# EAGLE design progduino (EAGLE 8.5.2)
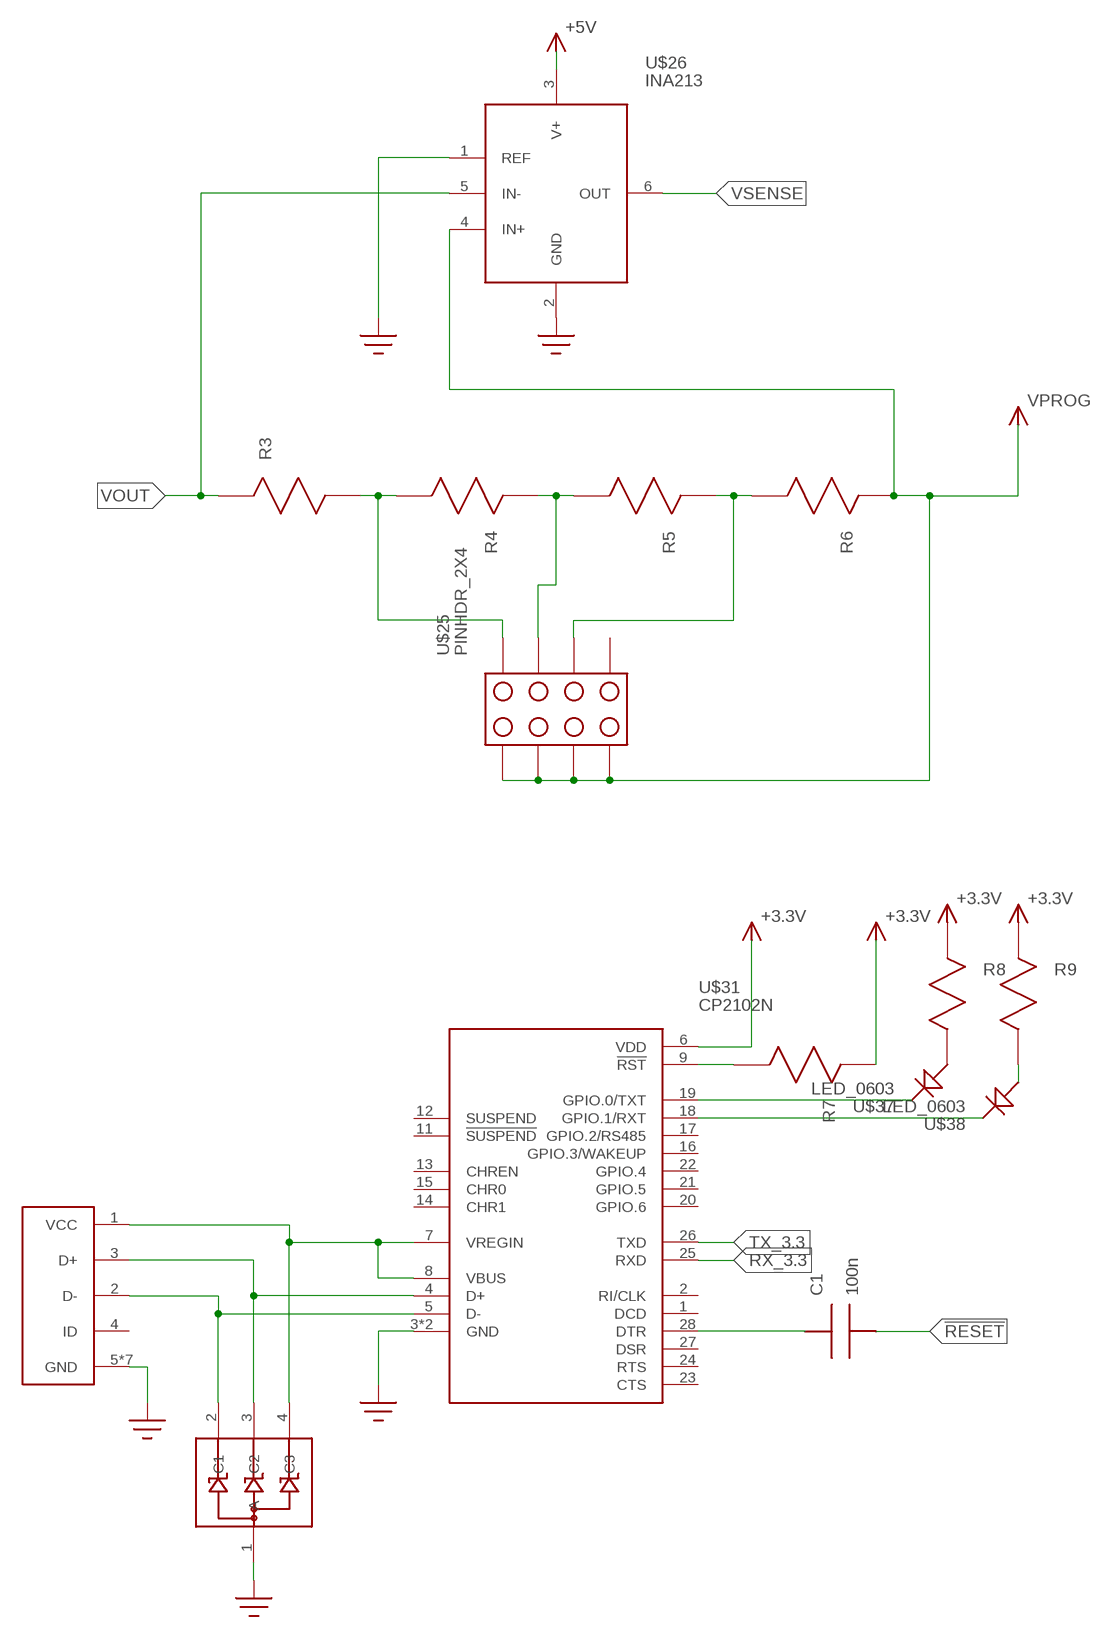
[diagram p0: schematic, sheet 1, part 1 of 2]
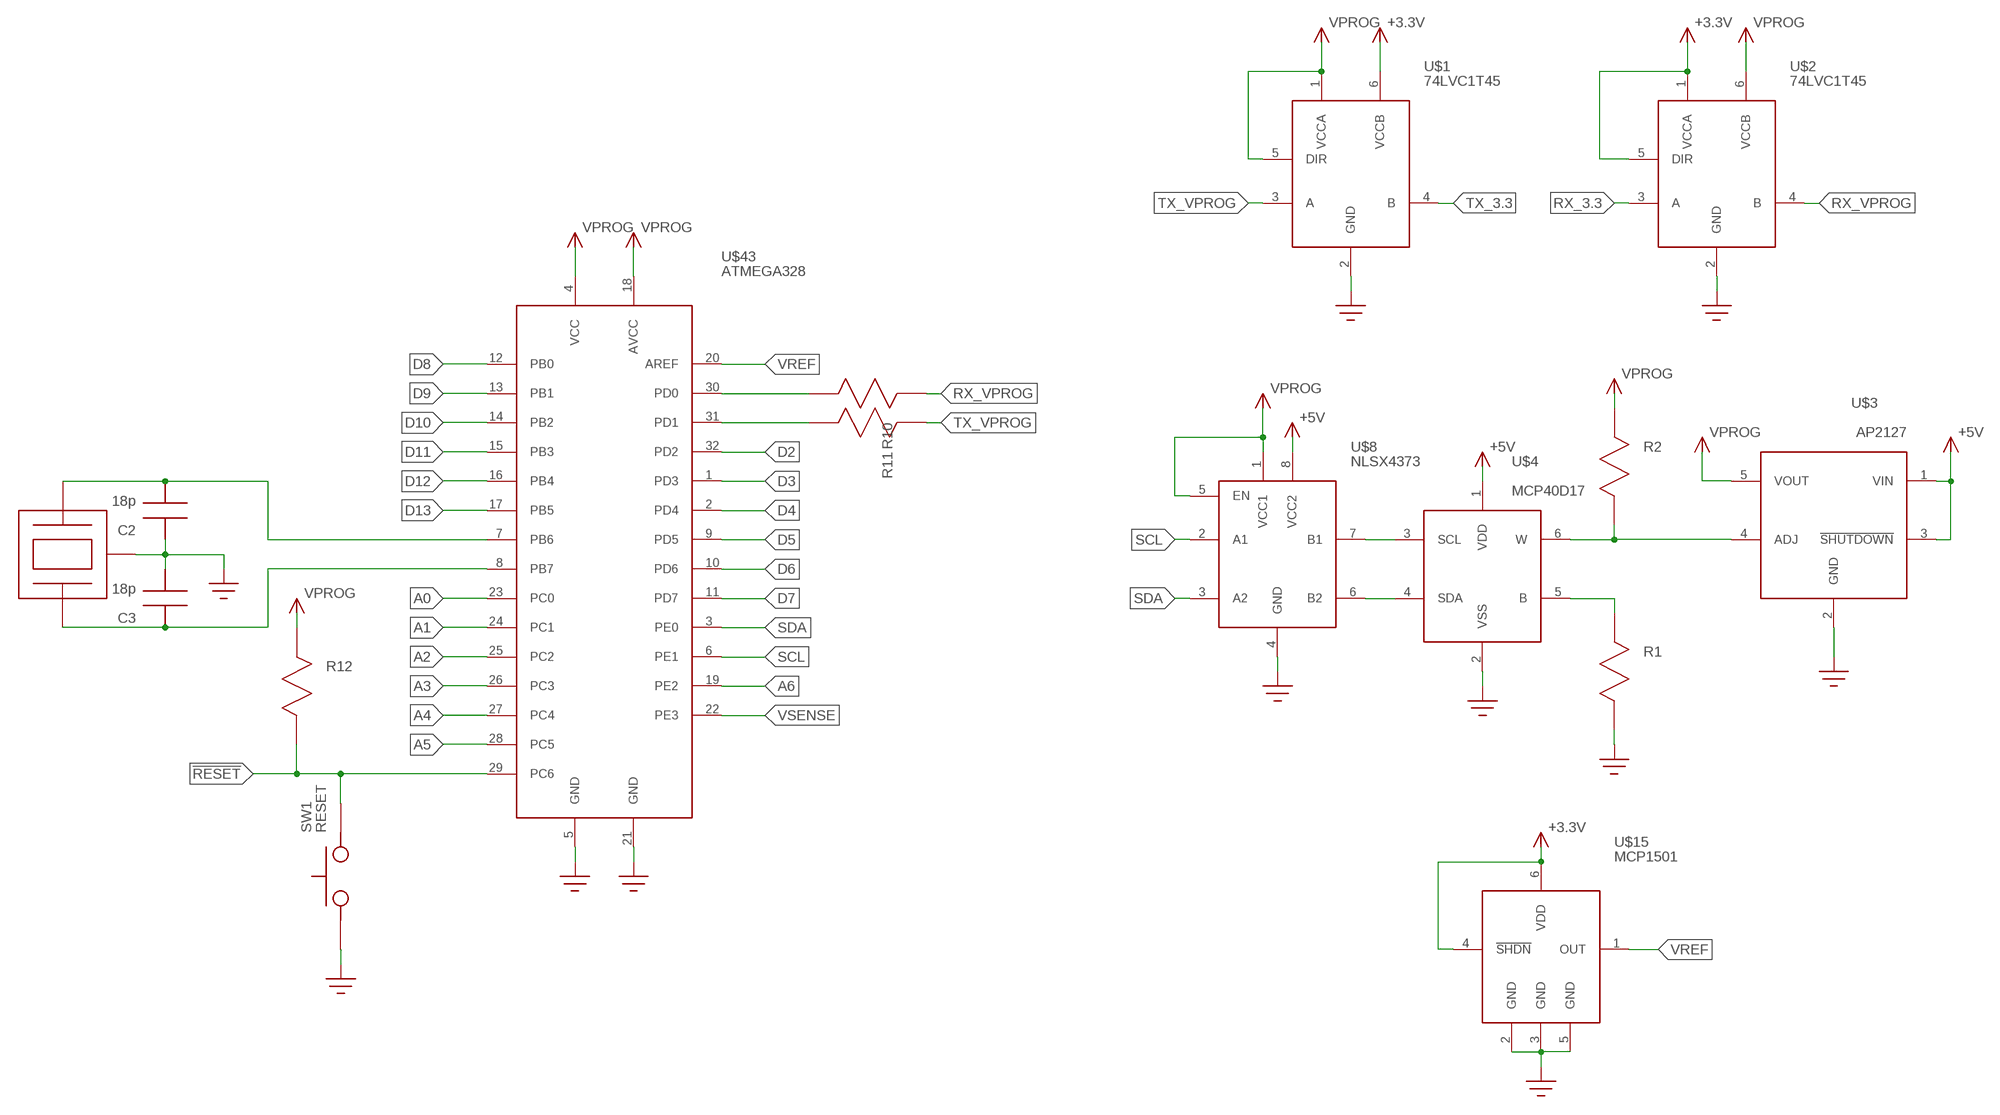
[diagram p1: schematic, sheet 1, part 2 of 2]

## Parts
C1  100n  C0603  [C0603]
C2  18p  C0603  [C0603]
C3  18p  C0603  [C0603]
R1  R0603  [R0603]
R2  R0603  [R0603]
R3  R0805  [R0805]
R4  R0805  [R0805]
R5  R0805  [R0805]
R6  R0805  [R0805]
R7  R0603  [R0603]
R8  R0603  [R0603]
R9  R0603  [R0603]
R10  R0603  [R0603]
R11  R0603  [R0603]
R12  R0603  [R0603]
SW1  RESET  SMD_SWITCH  [SMD_SWITCH]
U$1  74LVC1T45  [SOT23-6]
U$2  74LVC1T45  [SOT23-6]
U$3  AP2127  [SOT23-5]
U$4  MCP40D17  [SC70-6]
U$8  NLSX4373  [SOIC8]
U$15  MCP1501  [SOT23-6]
U$25  PINHDR_2X4  [PINHDR_2X4]
U$26  INA213  [SC70-6]
U$31  CP2102N  [QFN28]
U$37  LED_0603  [LED_0603]
U$38  LED_0603  [LED_0603]
U$39  USB_JACK  [FCI_MICRO_USB]
U$40  SP0503_TVS  [SOT143]
U$43  ATMEGA328  [TQFP32_7X7]
U$49  XTAL  [CRYSTAL_3.2X2.5]

## Nets
!RESET!: C1.P$2 R12.P$2 SW1.P$3 SW1.P$4 U$43.29(PC6)
+3.3V: R7.P$1 R8.P$1 R9.P$1 U$1.6(VCCB) U$2.1(VCCA) U$2.5(DIR) U$15.4(!SHDN!) U$15.6(VDD) U$31.6(VDD)
+5V: U$3.1(VIN) U$3.3(!SHUTDOWN!) U$4.1(VDD) U$8.8(VCC2) U$26.3(V+)
A0: U$43.23(PC0)
A1: U$43.24(PC1)
A2: U$43.25(PC2)
A3: U$43.26(PC3)
A4: U$43.27(PC4)
A5: U$43.28(PC5)
A6: U$43.19(PE2)
D2: U$43.32(PD2)
D3: U$43.1(PD3)
D4: U$43.2(PD4)
D5: U$43.9(PD5)
D6: U$43.10(PD6)
D7: U$43.11(PD7)
D8: U$43.12(PB0)
D9: U$43.13(PB1)
D10: U$43.14(PB2)
D11: U$43.15(PB3)
D12: U$43.16(PB4)
D13: U$43.17(PB5)
GND: C2.P$1 C3.P$2 R1.P$2 SW1.P$1 SW1.P$2 U$1.2(GND) U$2.2(GND) U$3.2(GND) U$4.2(VSS) U$8.4(GND) U$15.2(GND) U$15.3(GND) U$15.5(GND) U$26.1(REF) U$26.2(GND) U$31.3(GND) U$31.PAD(GND) U$39.5(GND) U$39.GND1(GND) U$39.GND2(GND) U$39.GND3(GND) U$39.GND4(GND) U$39.GND5(GND) U$39.GND6(GND) U$40.1(A) U$43.5(GND) U$43.21(GND) U$49.P$2(P$CASE) U$49.P$4(P$CASE)
N$1: R2.P$2 U$3.4(ADJ) U$4.6(W)
N$2: R1.P$1 U$4.5(B)
N$3: U$4.3(SCL) U$8.7(B1)
N$4: U$4.4(SDA) U$8.6(B2)
N$5: R3.P$2 R4.P$2 U$25.8
N$6: R4.P$1 R5.P$2 U$25.7
N$7: R5.P$1 R6.P$2 U$25.6
N$8: R7.P$2 U$31.9(!RST!)
N$9: U$31.7(VREGIN) U$31.8(VBUS) U$39.1(VCC) U$40.4(C3)
N$10: R8.P$2 U$37.A
N$11: R9.P$2 U$38.A
N$12: U$31.19(GPIO.0/TXT) U$37.C
N$13: U$31.18(GPIO.1/RXT) U$38.C
N$14: U$31.5(D-) U$39.2(D-) U$40.2(C1)
N$15: U$31.4(D+) U$39.3(D+) U$40.3(C2)
N$17: C1.P$1 U$31.28(DTR)
N$18: R10.P$2 U$43.30(PD0)
N$19: R11.P$2 U$43.31(PD1)
N$25: C3.P$1 U$43.8(PB7) U$49.P$3(P$X2)
N$26: C2.P$2 U$43.7(PB6) U$49.P$1(P$X1)
RX_3.3: U$2.3(A) U$31.25(RXD)
RX_VPROG: R10.P$1 U$2.4(B)
SCL: U$8.2(A1) U$43.6(PE1)
SDA: U$8.3(A2) U$43.3(PE0)
TX_3.3: U$1.4(B) U$31.26(TXD)
TX_VPROG: R11.P$1 U$1.3(A)
VOUT: R3.P$1 U$26.5(IN-)
VPROG: R2.P$1 R6.P$1 R12.P$1 U$1.1(VCCA) U$1.5(DIR) U$2.6(VCCB) U$3.5(VOUT) U$8.1(VCC1) U$8.5(EN) U$25.1 U$25.2 U$25.3 U$25.4 U$26.4(IN+) U$43.4(VCC) U$43.18(AVCC)
VREF: U$15.1(OUT) U$43.20(AREF)
VSENSE: U$26.6(OUT) U$43.22(PE3)
Unconnected: U$25.5 U$31.1(DCD) U$31.2(RI/CLK) U$31.11(!SUSPEND!) U$31.12(SUSPEND) U$31.13(CHREN) U$31.14(CHR1) U$31.15(CHR0) U$31.16(GPIO.3/WAKEUP) U$31.17(GPIO.2/RS485) U$31.20(GPIO.6) U$31.21(GPIO.5) U$31.22(GPIO.4) U$31.23(CTS) U$31.24(RTS) U$31.27(DSR) U$39.4(ID)

## Library data of the parts
C1-C3 = progduino:C
R1-R12 = progduino:R
SW1 = progduino:SMD_SWITCH
U$1 U$2 = progduino:74LVC1T45
U$3 = progduino:AP2127
U$4 = progduino:MCP40D17
U$8 = progduino:NLSX4373
U$15 = progduino:MCP1501
U$25 = progduino:PINHDR_2X4
U$26 = progduino:INA213
U$31 = progduino:CP2102N
U$37 U$38 = progduino:LED_0603
U$39 = progduino:USB_JACK
U$40 = progduino:SP0503_TVS
U$43 = progduino:ATMEGA328
U$49 = progduino:XTAL

## Board
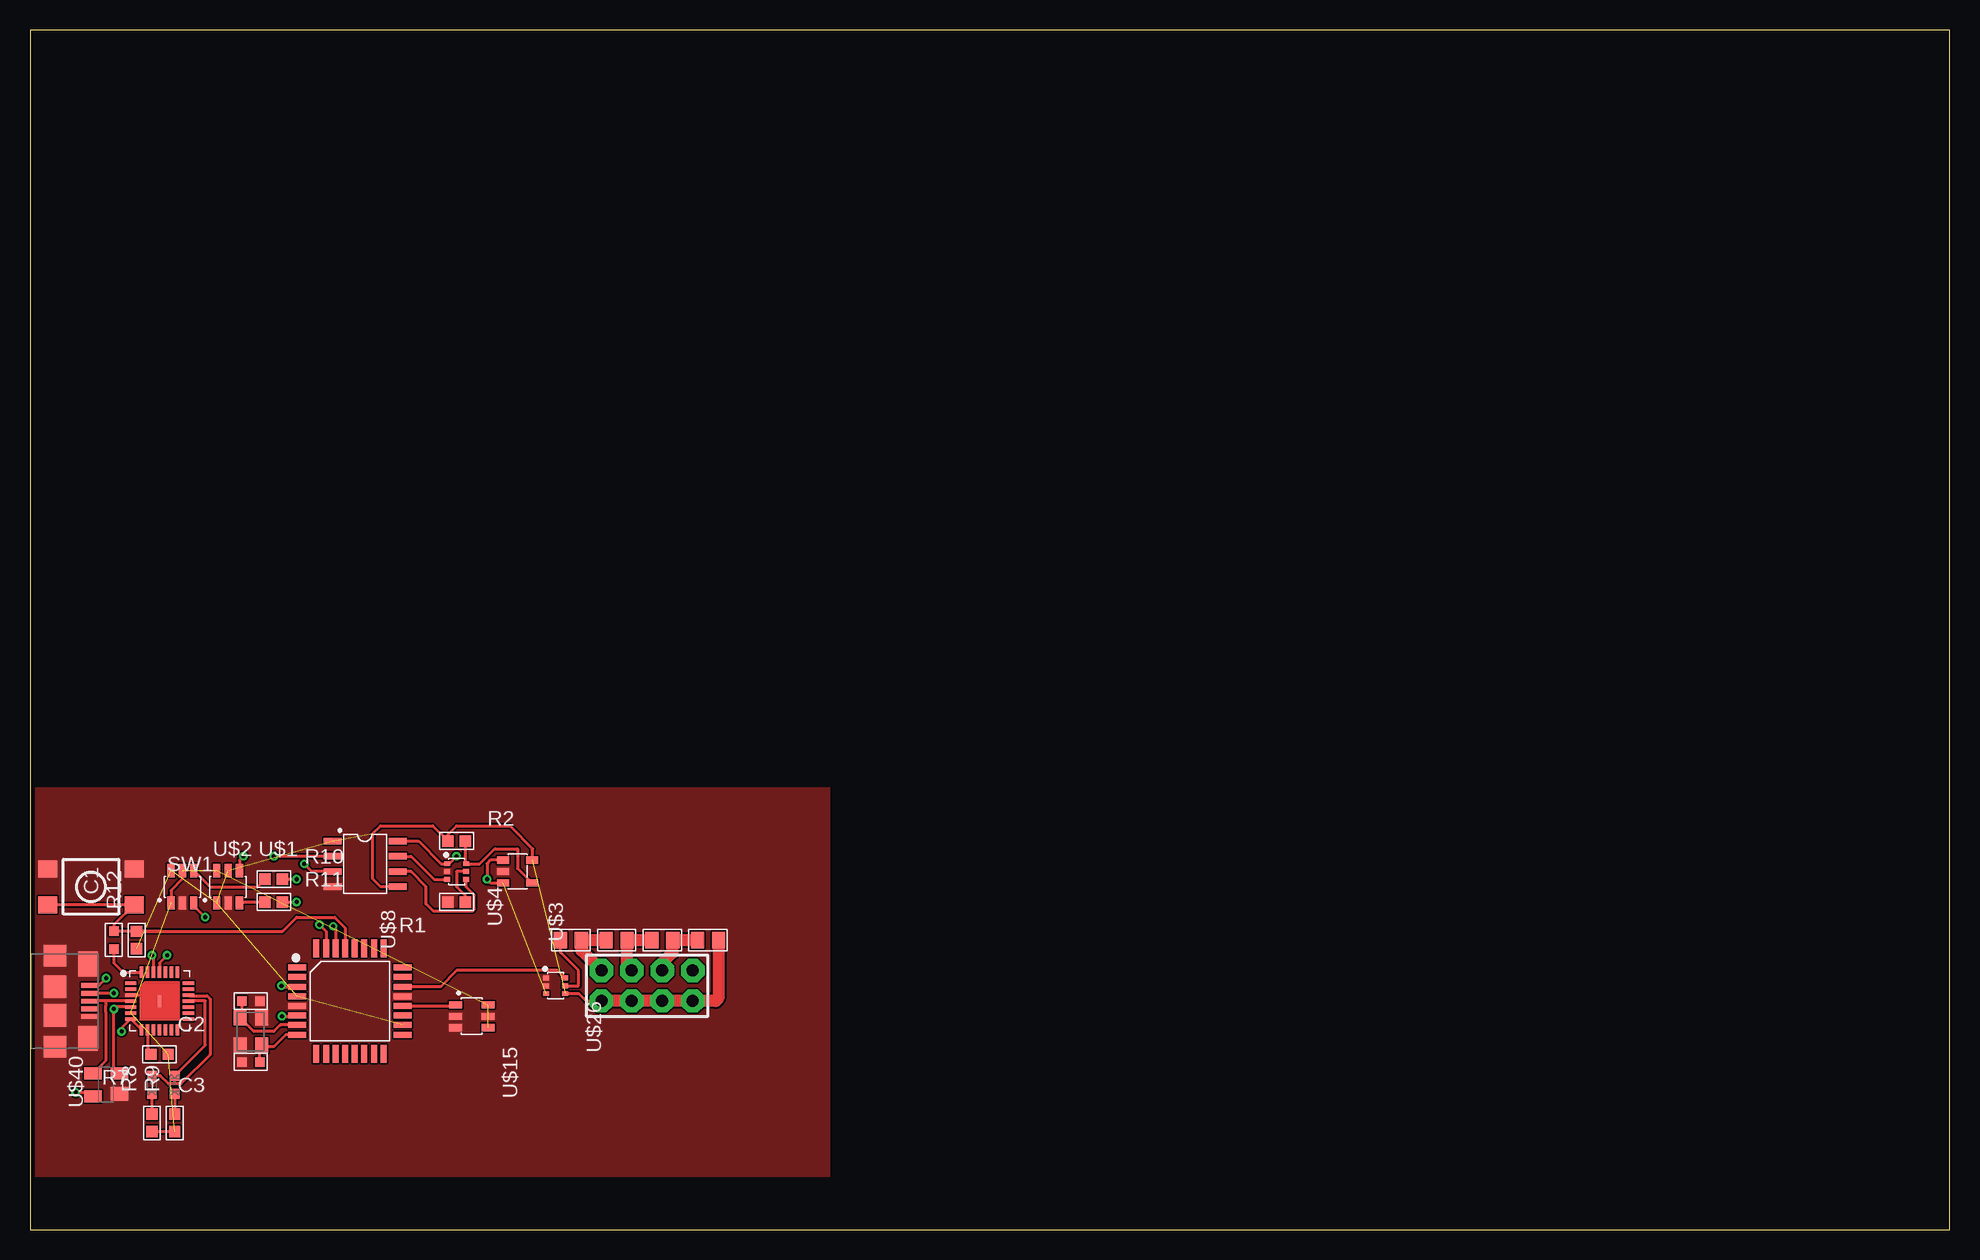
[diagram p2: board, top side]
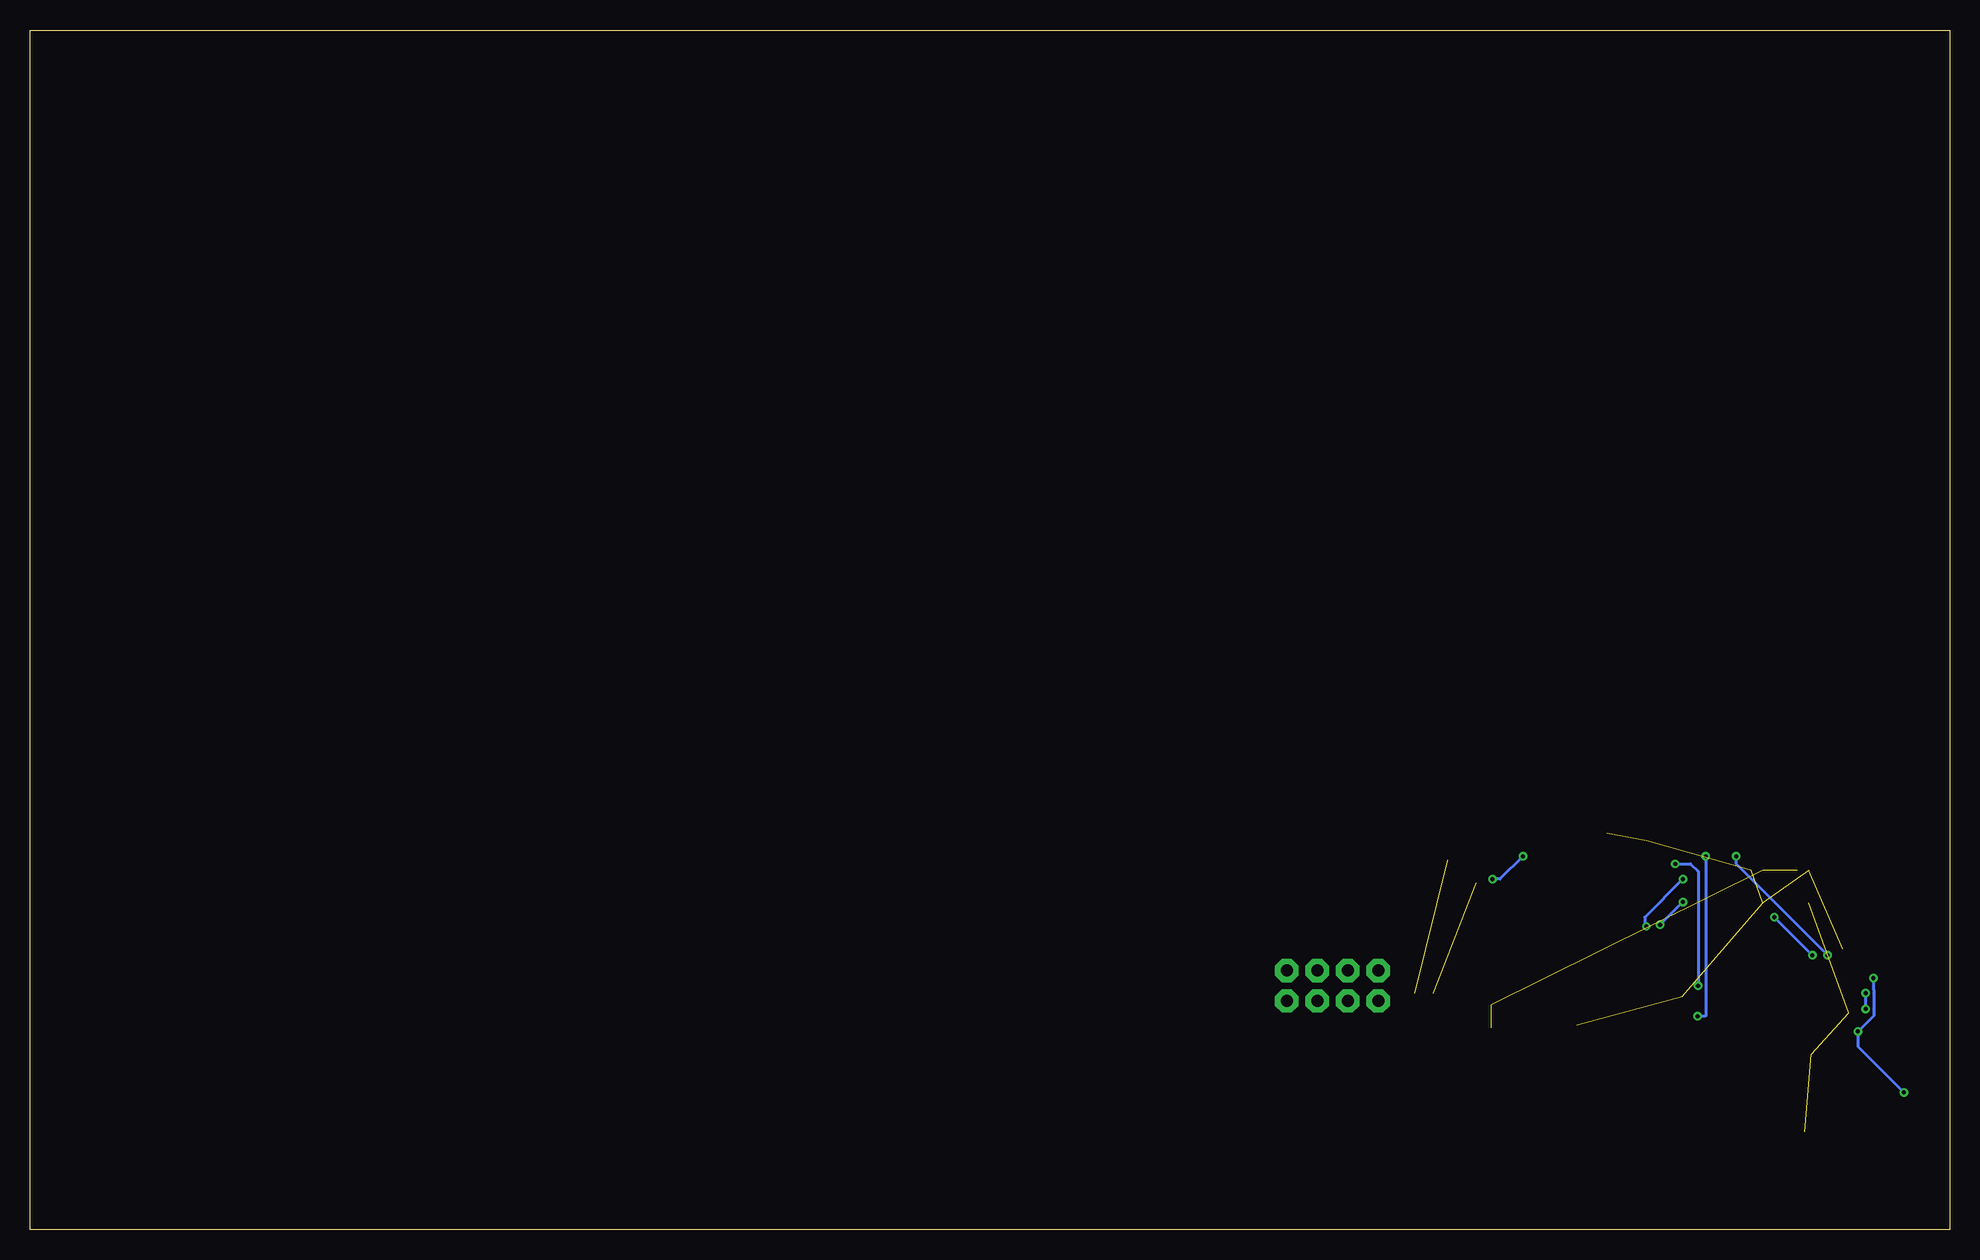
[diagram p3: board, bottom side, seen from below]

Size 160 x 100 mm. Coordinates in mm from the lower left corner, seen from the top.
Outline: 0,0 160,0 160,100 0,100 0,0
Copper layers (1*16): Top 0.0356mm / dielectric 1.5011mm / Bottom 0.0356mm
Design rules "LaenPCBOrder": minimum track width 6mil, minimum drill 13mil, track to track 6mil, track to pad 6mil, pad to pad 6mil, via to via 6mil, smd to smd 6mil, copper to edge 15mil, drill to drill 6mil, minimum pad ring 7mil, minimum via ring 7mil, stop-mask expansion 3mil, vias tented up to drill 0mil, thermal gap 10mil

### Footprints (pad centres in the part's own frame; a part is rotated, then mirrored left to right if it is on the bottom)
C0603 = smd 0.8 x 0.8: P$1 -0.75,0; P$2 0.75,0
R0603 = smd 0.95 x 0.95: P$1 -0.725,0; P$2 0.725,0
R0805 = smd 1.1 x 1.4: P$1 -0.875,0; P$2 0.875,0
SMD_SWITCH = smd 1.6 x 1.4: P$1 -3.6,1.5; P$2 3.6,1.5; P$3 3.6,-1.5; P$4 -3.6,-1.5
SOT23-6 = smd 0.6 x 1.1: 1 -0.95,-1.35; 2 0,-1.35; 3 0.95,-1.35; 4 0.95,1.35; 5 0,1.35; 6 -0.95,1.35
SOT23-5 = smd 0.6 x 1: 1 -0.95,-1.2; 2 0,-1.2; 3 0.95,-1.2; 4 0.95,1.2; 5 -0.95,1.2
SC70-6 = smd 0.4 x 0.5: 1 -0.65,-0.8; 2 0,-0.8; 3 0.65,-0.8; 4 0.65,0.8; 5 0,0.8; 6 -0.65,0.8
SOIC8 = smd 0.55 x 1.5: 1 -1.905,-2.7; 2 -0.635,-2.7; 3 0.635,-2.7; 4 1.905,-2.7; 5 1.905,2.7; 6 0.635,2.7; 7 -0.635,2.7; 8 -1.905,2.7
PINHDR_2X4 = drill 1 pad 1.93 octagon: 1 -3.81,-1.27; 2 -1.27,-1.27; 3 1.27,-1.27; 4 3.81,-1.27; 5 3.81,1.27; 6 1.27,1.27; 7 -1.27,1.27; 8 -3.81,1.27
QFN28 = smd 0.95 x 0.3: 1 -2.4,1.5; 2 -2.4,1; 3 -2.4,0.5; 4 -2.4,0; 5 -2.4,-0.5; 6 -2.4,-1; 7 -2.4,-1.5; 15 2.4,-1.5; 16 2.4,-1; 17 2.4,-0.5; 18 2.4,0; 19 2.4,0.5; 20 2.4,1; 21 2.4,1.5 | smd 0.3 x 0.95: 8 -1.5,-2.4; 9 -1,-2.4; 10 -0.5,-2.4; 11 0,-2.4; 12 0.5,-2.4; 13 1,-2.4; 14 1.5,-2.4; 22 1.5,2.4; 23 1,2.4; 24 0.5,2.4; 25 0,2.4; 26 -0.5,2.4; 27 -1,2.4; 28 -1.5,2.4; PAD 0,0
LED_0603 = smd 0.8 x 0.8: A -0.75,0; C 0.75,0
FCI_MICRO_USB = smd 0.4 x 1.35: 1 -1.3,4.325; 2 -0.65,4.325; 3 0,4.325; 4 0.65,4.325; 5 1.3,4.325 | smd 1.8 x 1.9: GND1 -3.8,1.45; GND4 3.8,1.45 | smd 1.9 x 1.9: GND2 -1.2,1.45; GND3 1.2,1.45 | smd 2.1 x 1.6: GND5 -3.1,4.2; GND6 3.1,4.2
SOT143 = smd 1.2 x 1.44: 1 -0.75,-1.1 | smd 1 x 1.44: 2 0.95,-1.1; 3 0.95,1.1; 4 -0.95,1.1
TQFP32_7X7 = smd 1.5 x 0.5: 1 -4.4,2.8; 2 -4.4,2; 3 -4.4,1.2; 4 -4.4,0.4; 5 -4.4,-0.4; 6 -4.4,-1.2; 7 -4.4,-2; 8 -4.4,-2.8; 17 4.4,-2.8; 18 4.4,-2; 19 4.4,-1.2; 20 4.4,-0.4; 21 4.4,0.4; 22 4.4,1.2; 23 4.4,2; 24 4.4,2.8 | smd 0.5 x 1.5: 9 -2.8,-4.4; 10 -2,-4.4; 11 -1.2,-4.4; 12 -0.4,-4.4; 13 0.4,-4.4; 14 1.2,-4.4; 15 2,-4.4; 16 2.8,-4.4; 25 2.8,4.4; 26 2,4.4; 27 1.2,4.4; 28 0.4,4.4; 29 -0.4,4.4; 30 -1.2,4.4; 31 -2,4.4; 32 -2.8,4.4
CRYSTAL_3.2X2.5 = smd 1.3 x 1.1: P$1 -1.15,-0.9; P$2 1.15,-0.9; P$3 1.15,0.9; P$4 -1.15,0.9

### Placement (x,y rotation side)
C1  6.99,24.13 90 top
C2  18.41,19.05 180 top
C3  18.41,13.97 180 top
R1  35.56,27.3 180 top
R2  35.56,32.38 0 top
R3  45.09,24.13 0 top
R4  48.9,24.13 180 top
R5  52.7,24.13 180 top
R6  56.52,24.13 180 top
R7  10.79,14.61 180 top
R8  10.16,8.89 90 top
R9  12.06,8.89 90 top
R10  20.32,29.21 0 top
R11  20.32,27.3 0 top
R12  8.89,24.13 90 top
SW1  5.08,28.57 0 top
U$1  16.51,28.57 0 top
U$2  12.7,28.57 0 top
U$3  40.64,29.84 270 top
U$4  35.56,29.84 270 top
U$8  27.94,30.48 270 top
U$15  36.83,17.78 270 top
U$25  51.44,20.32 0 top
U$26  43.81,20.32 270 top
U$31  10.79,19.05 0 top
U$37  10.16,12.06 90 top
U$38  12.06,12.06 90 top
U$39  0.64,19.05 270 top
U$40  6.35,12.06 90 top
U$43  26.67,19.05 0 top
U$49  18.41,16.51 270 top

### Tracks (layer width: path | path; a pad name or v marks a point on that pad's centre or on a via)
!RESET!
  Top 0.254: C1.P$2 6.78,25.09 | SW1.P$4 SW1.P$3 6.99,25.38 C1.P$2 | C1.P$2 10.77,24.88 R12.P$2 21.05,24.86 22.23,26.04 25.4,26.04 26.27,25.16 U$43.29
+3.3V  (6 unrouted)
  Top 0.254: R9.P$1 R8.P$1 | U$2.5 12.7,29.21 11.75,28.26 U$2.1
+5V  (via drill 0.35)  (1 unrouted)
  Top 0.254: U$8.8 32.38,32.38 34.29,30.48 34.74,30.48 U$4.1 34.94,30.5 v35.56,31.11 | U$3.1 38.41,30.8 38.1,30.48 v38.1,29.21 38.41,28.89 U$3.3
  Bottom 0.254: v35.56,31.11 37.47,29.21 v38.1,29.21
GND
  Top 0.254: U$31.3 10.29,19.55 U$31.PAD
  pour Top (no thermals): 0,4.45 66.67,4.45 66.67,36.83 0,36.83
N$1
  Top 0.254: R2.P$2 36.28,30.57 U$4.6 37.48,30.5 38.73,31.75 40.64,31.75 40.64,30.09 U$3.4
N$2
  Top 0.254: U$4.5 35.56,29.84 35.56,28.57 36.28,27.85 R1.P$1
N$3
  Top 0.254: U$8.7 31.75,31.11 33.67,29.2 U$4.3
N$4
  Top 0.254: U$4.4 36.36,28.57 37.04,27.9 37.04,26.71 36.88,26.55 33.61,26.55 33.02,27.14 33.02,28.57 31.75,29.84 U$8.6
N$5
  Top 1.016: R4.P$2 R3.P$2 45.96,23.25 U$25.8
N$6
  Top 1.016: R5.P$2 R4.P$1 49.77,21.98 U$25.7
N$7
  Top 1.016: R6.P$2 R5.P$1 53.58,23.1 52.7,22.23 U$25.6
N$8
  Top 0.254: U$31.9 9.79,14.88 R7.P$2
N$9  (via drill 0.35)
  Top 0.254: U$39.1 5.75,20.35 v6.35,20.95 | v7.64,16.51 7.64,16.8 U$31.7 U$31.8 | v3.81,11.43 4.93,11.43 U$40.4
  Bottom 0.254: v6.35,20.95 6.35,20 6.33,19.98 6.33,17.8 7.62,16.51 v7.64,16.51 7.64,15.26 v3.81,11.43
N$10
  Top 0.254: U$37.A R8.P$2
N$11
  Top 0.254: U$38.A R9.P$2
N$12
  Top 0.254: U$31.19 13.27,19.48 14.75,19.48 15.01,19.22 15.01,14.57 12.58,12.14 11.55,12.14 10.87,12.81 U$37.C
N$13
  Top 0.254: U$38.C 14.61,15.36 14.61,19.05 U$31.18
N$14  (via drill 0.35)
  Top 0.254: U$31.5 7.12,18.55 6.99,18.41 v6.99,18.39 6.99,13.48 U$40.2 | v6.99,19.71 U$39.2
  Bottom 0.254: v6.99,18.39 v6.99,19.71
N$15
  Top 0.254: U$31.4 6.35,19.05 | 6.35,19.05 U$39.3 | U$40.3 6.35,14.12 6.35,18.1 6.33,18.12 6.33,18.66 6.35,18.69 6.35,19.05
N$17
  Top 0.254: C1.P$1 6.99,22.23 7.76,21.45 U$31.28
N$18  (via drill 0.35)
  Top 0.254: R10.P$2 v22.23,29.21 | v25.27,25.27 25.47,25.07 U$43.30
  Bottom 0.254: v22.23,29.21 25.4,26.04 25.4,25.4 v25.27,25.27
N$19  (via drill 0.35)
  Top 0.254: R11.P$2 v22.23,27.3 | v24.13,25.4 24.67,24.86 U$43.31
  Bottom 0.254: v22.23,27.3 v24.13,25.4
N$25
  Top 0.254: C3.P$1 19.16,15.21 U$49.P$3 19.43,15.24 20.32,15.24 21.33,16.25 U$43.8
N$26
  Top 0.254: C2.P$2 17.66,17.81 U$49.P$1 18.66,16.51 20.32,16.51 20.86,17.05 U$43.7
RX_3.3  (via drill 0.35)
  Top 0.254: v14.61,26.04 13.65,26.99 U$2.3 | v11.43,22.86 10.79,22.23 U$31.25
  Bottom 0.254: v11.43,22.86 v14.61,26.04
RX_VPROG
  Top 0.254: U$2.4 15,28.57 18.96,28.57 R10.P$1
SCL  (via drill 0.35)
  Top 0.254: U$8.2 v20.32,31.11 | v21,17.78 22.2,17.78 U$43.6
  Bottom 0.254: v20.32,31.11 20.32,17.78 v21,17.78
SDA  (via drill 0.35)
  Top 0.254: U$8.3 23.5,29.84 v22.86,30.48 | v20.95,20.32 21.02,20.25 U$43.3
  Bottom 0.254: v22.86,30.48 21.59,30.48 20.95,29.84 v20.95,20.32
TX_3.3  (via drill 0.35)
  Top 0.254: U$31.26 10.29,22.73 v10.16,22.86 | v17.78,31.11 17.46,30.8 U$1.4
  Bottom 0.254: v10.16,22.86 17.78,30.48 v17.78,31.11
TX_VPROG
  Top 0.254: U$1.3 17.54,27.3 R11.P$1
VOUT
  Top 0.254: U$26.5 45.72,20.32 45.72,21.59 44.21,23.1 R3.P$1
VPROG  (8 unrouted)
  Top 0.254: U$8.5 29.21,28.57 28.57,29.21 28.57,33.02 29.21,33.66 33.56,33.66 R2.P$1 34.84,32.93 35.56,33.66 40.01,33.66 41.91,31.75 41.84,31.68 U$3.5 | U$26.4 45.73,19.67 46.35,19.05 U$25.1
  Top 1.016: R6.P$1 57.39,19.29 57.15,19.05 U$25.4 U$25.3 U$25.2 U$25.1
VREF
  Top 0.254: U$43.20 35.4,18.65 U$15.1
VSENSE
  Top 0.254: U$26.6 43.99,21.59 35.56,21.59 34.22,20.25 U$43.22